# Altium project MOC3021 Opto Isolator Driver V1.2.PrjPCB
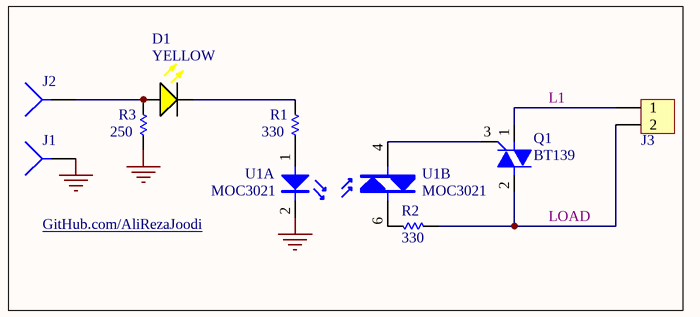
[diagram p0: Main.SchDoc]
1 sheet, 9 parts. Net scope: global (net labels, ports and power ports of the same name join across sheets).
Board file: PCB.PcbDoc

## Sheet Main.SchDoc
size 101 x 45 mm

### Parts
D1  YELLOW  [LED_THD_5MM_YELLOW]
J1  1PIN  [TestPoint_THD_A]  (value not drawn)
J2  1PIN  [TestPoint_THD_A]  (value not drawn)
J3  2PIN  [Connector_Phoenix_2PIN_MSTB]  (value not drawn)
Q1  BT139  [TO220_3PIN_V]
R1  330  [R_SMD_0805_EXPANDED]
R2  330  [R_SMD_0805_EXPANDED]
R3  250  [R_THD_AXIAL0.4(1/4W)]
U1  MOC3021  [DIP_6]  (parts A,B of 2)

### Nets
GND: J1.1(A) R3.2 U1.2(K)
L1: J3.1 Q1.1(T1)
LOAD: J3.2 Q1.2(T2) R2.2
NetD1_1: D1.1(A) J2.1(A) R3.1
NetD1_2: D1.2(K) R1.1
NetQ1_3: Q1.3(G) U1.4(A/K)
NetR1_2: R1.2 U1.1(A)
NetR2_1: R2.1 U1.6(A/K)

### Notes on the sheet
- GitHub.com/AliRezaJoodi

### Library data of the parts
D1 = LED_YELLOW: LED, Yellow; Manufacturer: Generic Components; Class I: Optoelectronic; Published: 8-Jun-2000; Revision: July-2002: Re-released for DXP Platform.; Publisher: Altium Limited; Class II: LED
J1 J2 = Connector_Socket_1Pin_Female: Connector, Socket, 1Pin; Revision: July-2002: Re-released for DXP Platform.
J3 = Connector_Header_2Pin: Connector, Header, 2Pin; Revision: July-2002: Re-released for DXP Platform.
Q1 = Triac: Triac,
R1-R3 = Resistor: Revision: July-2002: Re-released for DXP Platform.
U1 = MOC3021: Opto-Triac